# EAGLE design control board 1 (EAGLE 7.6.0)
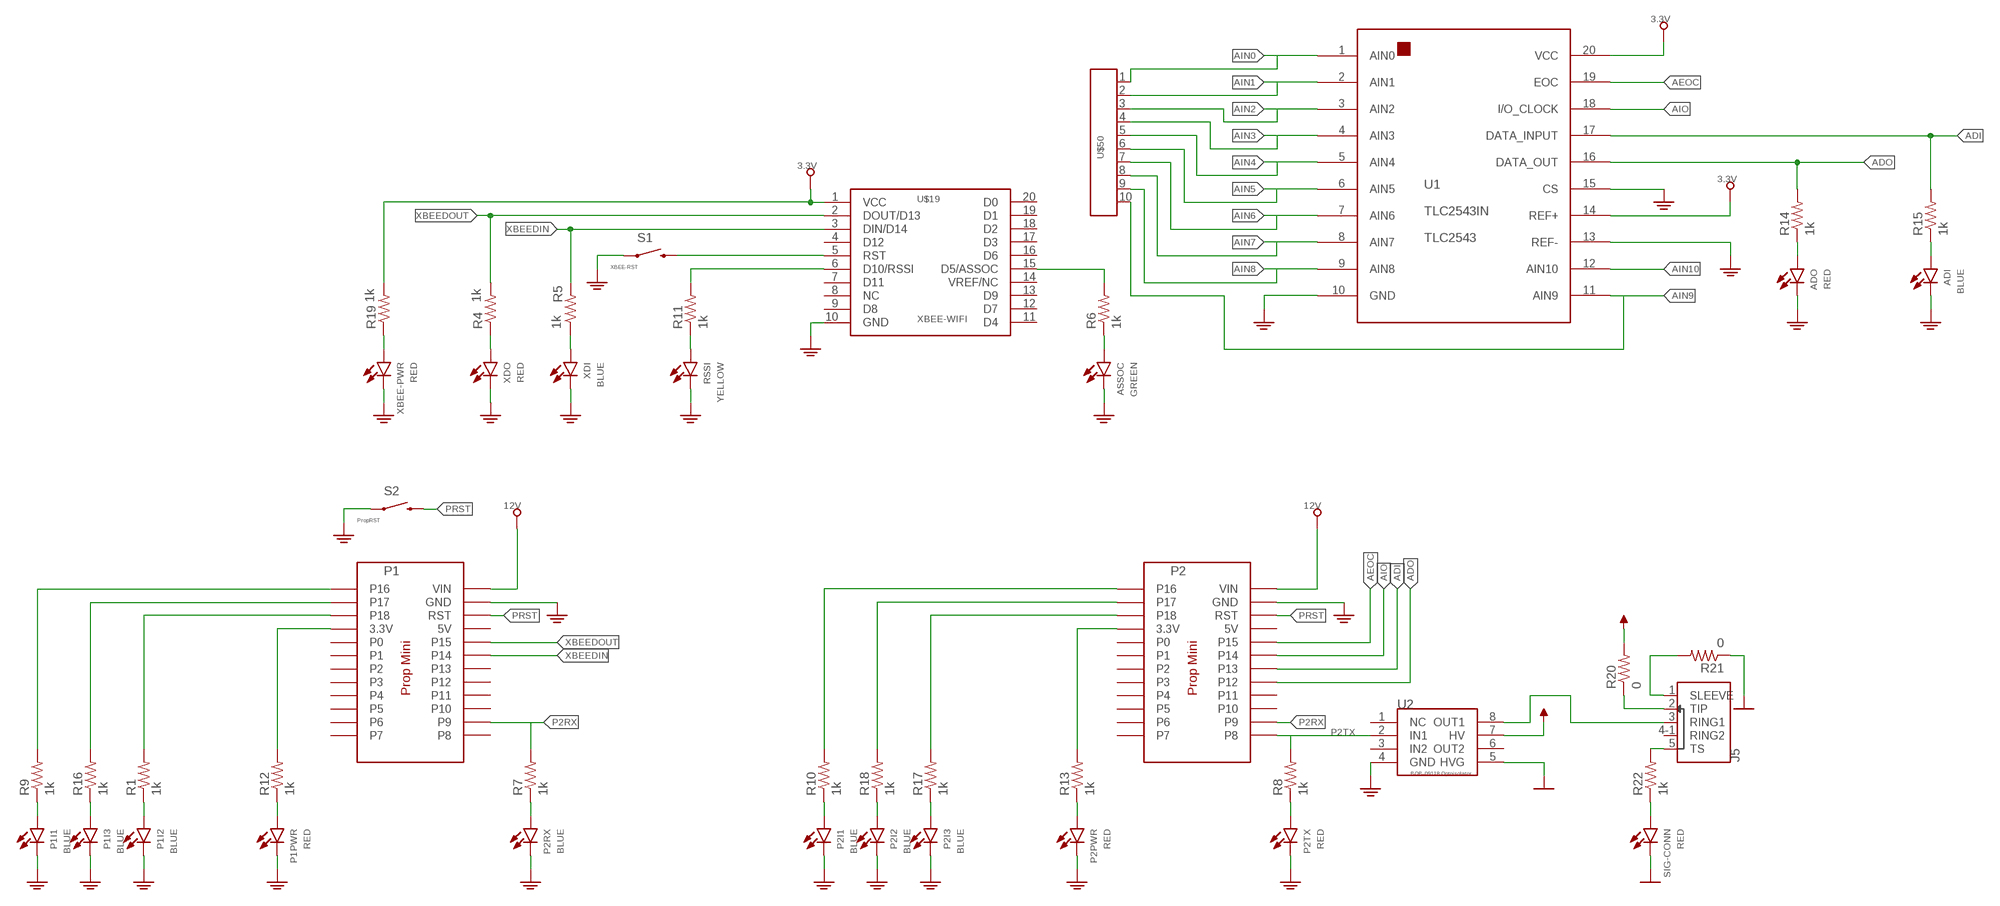
[diagram p0: schematic, sheet 1, part 1 of 2]
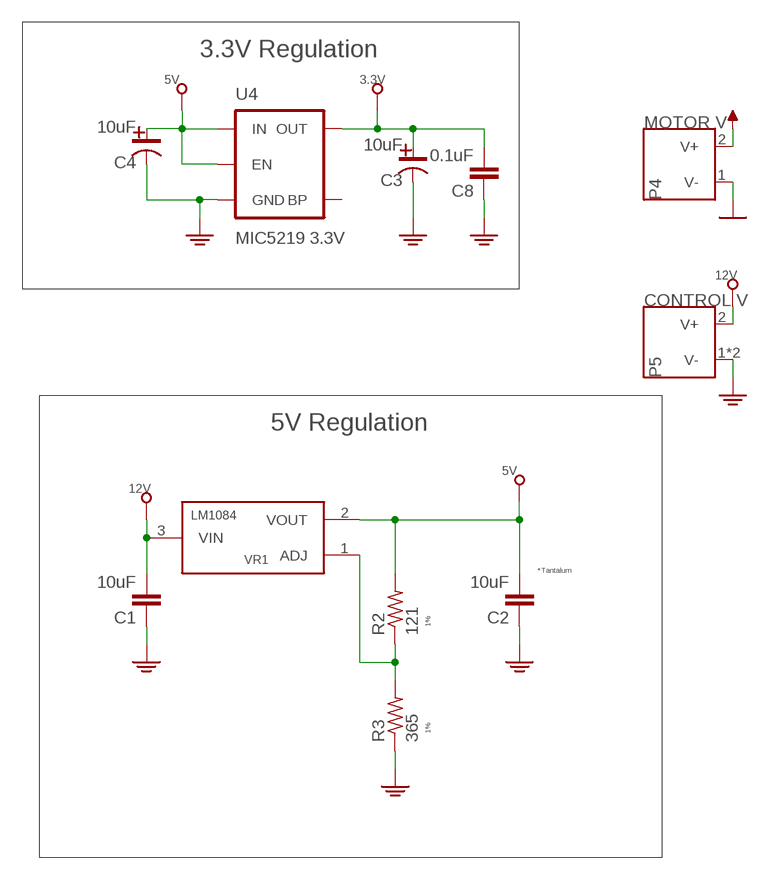
[diagram p1: schematic, sheet 1, part 2 of 2]

## Parts
ADI  BLUE  LED-STD  [0603]
ADO  RED  LED-STD  [0603]
ASSOC  GREEN  LED-STD  [0603]
C1  10uF  C0603  [0603]
C2  10uF  C0603  [0603]
C3  10uF  C-POL-T  [0603-POL]
C4  10uF  C-POL-T  [0603-POL]
C8  0.1uF  C0603  [0603]
J5  SJ1-42535TS  [SJ1-42534-SMT]
P1  PROP-MINI  [PROP-MINI]
P1I1  BLUE  LED-STD  [0603]
P1I2  BLUE  LED-STD  [0603]
P1I3  BLUE  LED-STD  [0603]
P1PWR  RED  LED-STD  [0603]
P2  PROP-MINI  [PROP-MINI]
P2I1  BLUE  LED-STD  [0603]
P2I2  BLUE  LED-STD  [0603]
P2I3  BLUE  LED-STD  [0603]
P2PWR  RED  LED-STD  [0603]
P2RX  BLUE  LED-STD  [0603]
P2TX  RED  LED-STD  [0603]
P4  MOTOR V  SINGLE-LINE"  [PJ-002BH-SMT-TR]
P5  CONTROL V  SINGLE-LINE'  [PJ-037A]
R1  1k  R0603  [0603]
R2  121  R0603  [0603]
R3  365  R0603  [0603]
R4  1k  R0603  [0603]
R5  1k  R0603  [0603]
R6  1k  R0603  [0603]
R7  1k  R0603  [0603]
R8  1k  R0603  [0603]
R9  1k  R0603  [0603]
R10  1k  R0603  [0603]
R11  1k  R0603  [0603]
R12  1k  R0603  [0603]
R13  1k  R0603  [0603]
R14  1k  R0603  [0603]
R15  1k  R0603  [0603]
R16  1k  R0603  [0603]
R17  1k  R0603  [0603]
R18  1k  R0603  [0603]
R19  1k  R0603  [0603]
R20  0  R0603  [0603]
R21  0  R0603  [0603]
R22  1k  R0603  [0603]
RSSI  YELLOW  LED-STD  [0603]
S1  XBEE-RST  SWITCH-MOMENTARY-2SMD-2  [TACTILE_SWITCH_SMD-2]
S2  PropRST  SWITCH-MOMENTARY-2SMD-2  [TACTILE_SWITCH_SMD-2]
SIG-CONN  RED  LED-STD  [0603]
U1  TLC2543IN  [DIL-20]
U2  BOB-09118  [DIL08-0.1P-6W]
U4  MIC5219 3.3V  V_REG_MIC52193.3V  [SOT23-5]
U$19  XBEE-WIFI  [XBEE-STD]
U$50  1X10  [DIP0.1-1X10]
VR1  LM1084  [TO-220]
XBEE-PWR  RED  LED-STD  [0603]
XDI  BLUE  LED-STD  [0603]
XDO  RED  LED-STD  [0603]

## Nets
3.3V: C3.2 C8.2 R19.2 U1.14(REF+) U1.20(VCC) U4.5(OUT) U$19.1(VCC)
5V: C2.2 C4.2 R2.2 U4.1(IN) U4.3(EN) VR1.2(VOUT)
12V: C1.2 P1.VIN P2.VIN P5.2(V+) VR1.3(VIN)
ADI: P2.P13 R15.2 U1.17(DATA_INPUT)
ADO: P2.P12 R14.2 U1.16(DATA_OUT)
AEOC: P2.P15 U1.19(EOC)
AIN0: U1.1(AIN0) U$50.1
AIN1: U1.2(AIN1) U$50.2
AIN2: U1.3(AIN2)
AIN3: U1.4(AIN3) U$50.4
AIN4: U1.5(AIN4) U$50.5
AIN5: U1.6(AIN5) U$50.6
AIN6: U1.7(AIN6) U$50.7
AIN7: U1.8(AIN7) U$50.8
AIN8: U1.9(AIN8) U$50.9
AIN9: U1.11(AIN9) U$50.10
AIN10: U1.12(AIN10)
AIO: P2.P14 U1.18(I/O_CLOCK)
GND: ADI.OUT ADO.OUT ASSOC.OUT C1.1 C2.1 C3.1 C4.1 C8.1 P1.GND P1I1.OUT P1I2.OUT P1I3.OUT P1PWR.OUT P2.GND P2I1.OUT P2I2.OUT P2I3.OUT P2PWR.OUT P2RX.OUT P2TX.OUT P5.1(V-) P5.1.(V-) R3.1 RSSI.OUT S1.2 S2.2 U1.10(GND) U1.13(REF-) U1.15(CS) U2.4(GND) U4.2(GND) U$19.10(GND) XBEE-PWR.OUT XDI.OUT XDO.OUT
GND2: P4.1(V-) R21.1 SIG-CONN.OUT U2.5(HVG)
N$1: R4.1 XDO.IN
N$2: P1I1.IN R9.1
N$3: P1.P18 R1.2
N$4: ADO.IN R14.1
N$5: R11.1 RSSI.IN
N$6: ADI.IN R15.1
N$7: R5.1 XDI.IN
N$8: J5.3(RING1) U2.8(OUT1)
N$9: R6.2 U$19.15(D5/ASSOC)
N$10: ASSOC.IN R6.1
N$11: P1.3.3V R12.2
N$12: P1I3.IN R16.1
N$13: P2.3.3V R13.2
N$14: P1I2.IN R1.1
N$15: P1PWR.IN R12.1
N$16: R19.1 XBEE-PWR.IN
N$17: J5.1(SLEEVE) R21.2
N$18: P2RX.IN R7.1
N$19: P2I1.IN R10.1
N$20: S1.1 U$19.5(RST)
N$21: R2.1 R3.2 VR1.1(ADJ)
N$22: R11.2 U$19.6(D10/RSSI)
N$23: P1.P16 R9.2
N$24: P2I2.IN R18.1
N$25: P2.P16 R10.2
N$26: P2I3.IN R17.1
N$27: P1.P17 R16.2
N$28: P2PWR.IN R13.1
N$29: P2.P18 R17.2
N$30: P2TX.IN R8.1
N$31: P2.P17 R18.2
N$32: J5.2(TIP) R20.1
N$33: R22.1 SIG-CONN.IN
N$34: J5.5(TS) R22.2
P2RX: P1.P9 P2.P9 R7.2
P2TX: P2.P8 R8.2 U2.2(IN1)
PRST: P1.RST P2.RST S2.1
VCC2: P4.2(V+) R20.2 U2.7(HV)
XBEEDIN: P1.P14 R5.2 U$19.3(DIN/D14)
XBEEDOUT: P1.P15 R4.2 U$19.2(DOUT/D13)
Unconnected: J5.4-1(RING2) P1.5V P1.P0 P1.P1 P1.P2 P1.P3 P1.P4 P1.P5 P1.P6 P1.P7 P1.P8 P1.P10 P1.P11 P1.P12 P1.P13 P2.5V P2.P0 P2.P1 P2.P2 P2.P3 P2.P4 P2.P5 P2.P6 P2.P7 P2.P10 P2.P11 U2.1(NC) U2.3(IN2) U2.6(OUT2) U4.4(BP) U$19.4(D12) U$19.7(D11) U$19.8(NC) U$19.9(D8) U$19.11(D4) U$19.12(D7) U$19.13(D9) U$19.14(VREF/NC) U$19.16(D6) U$19.17(D3) U$19.18(D2) U$19.19(D1) U$19.20(D0) U$50.3

## Notes on the sheet
- 3.3V Regulation
- 5V Regulation
- *Tantalum
- 1%
- 1%

## Library data of the parts
ADI ADO ASSOC P1I1-P1I3 P1PWR P2I1-P2I3 P2PWR P2RX P2TX RSSI SIG-CONN XBEE-PWR XDI XDO = led:LED-STD
C1 C2 C8 = RCL:C
C3 C4 = RCL:C-POL; CAP-TYPE: TANTALUM
J5 = audio-connectors:SJ1-42535; MNT: SMT
P1 P2 = Microcontrollers:PROP-MINI
P4 P5 = PWR-Connectors:SINGLE-LINE: 4UCON Part Num: 18742
R1-R22 = RCL:R
S1 S2 = SparkFun-Electromechanical:SWITCH-MOMENTARY-2: Various NO switches- pushbuttons, reed, etc; PROD_ID: SWCH-09213
U1 = ADC:TLC2543IN
U2 = Optoisolation:BOB-09118
U4 = SparkFun-PowerIC:V_REG_MIC5219: V_REG MIC5219 Standard 3.3V and 5V 500mA LDO voltage regulator in SOT-23 layout. Micrel part MIC5219. BP (by-pass) pin is used to lower output noise with 470pF cap, may be left open.; PROD_ID: VREG-09872
U$19 = RF:XBEE-WIFI
U$50 = headers:1X10; DIP: 0.1
VR1 = Voltage Regulators:LM1084

## Board
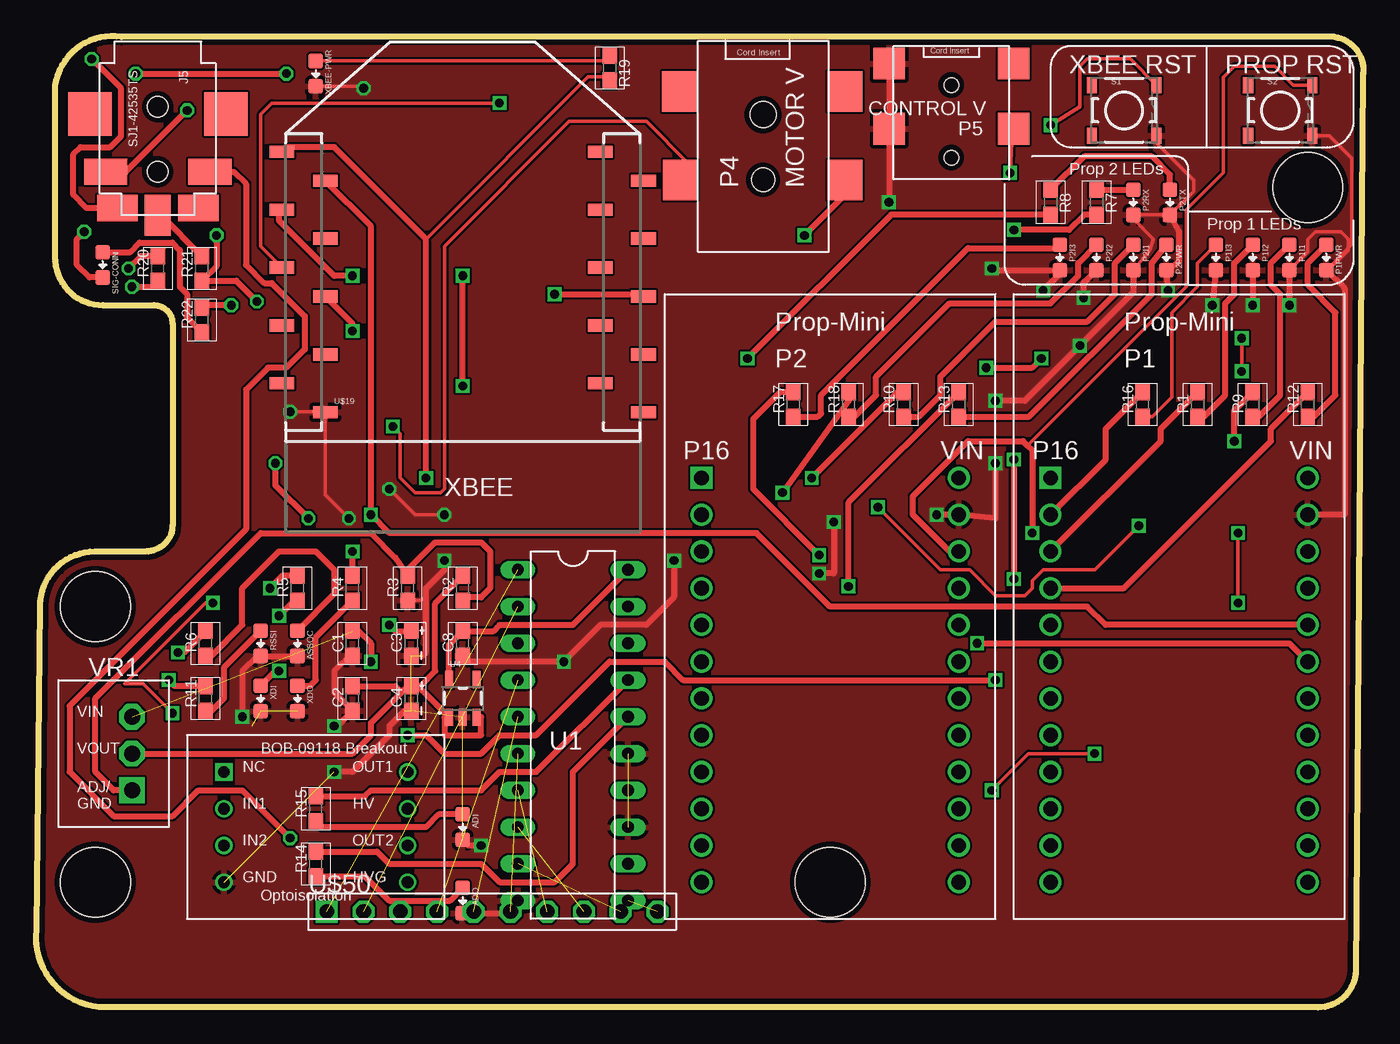
[diagram p2: board, top side]
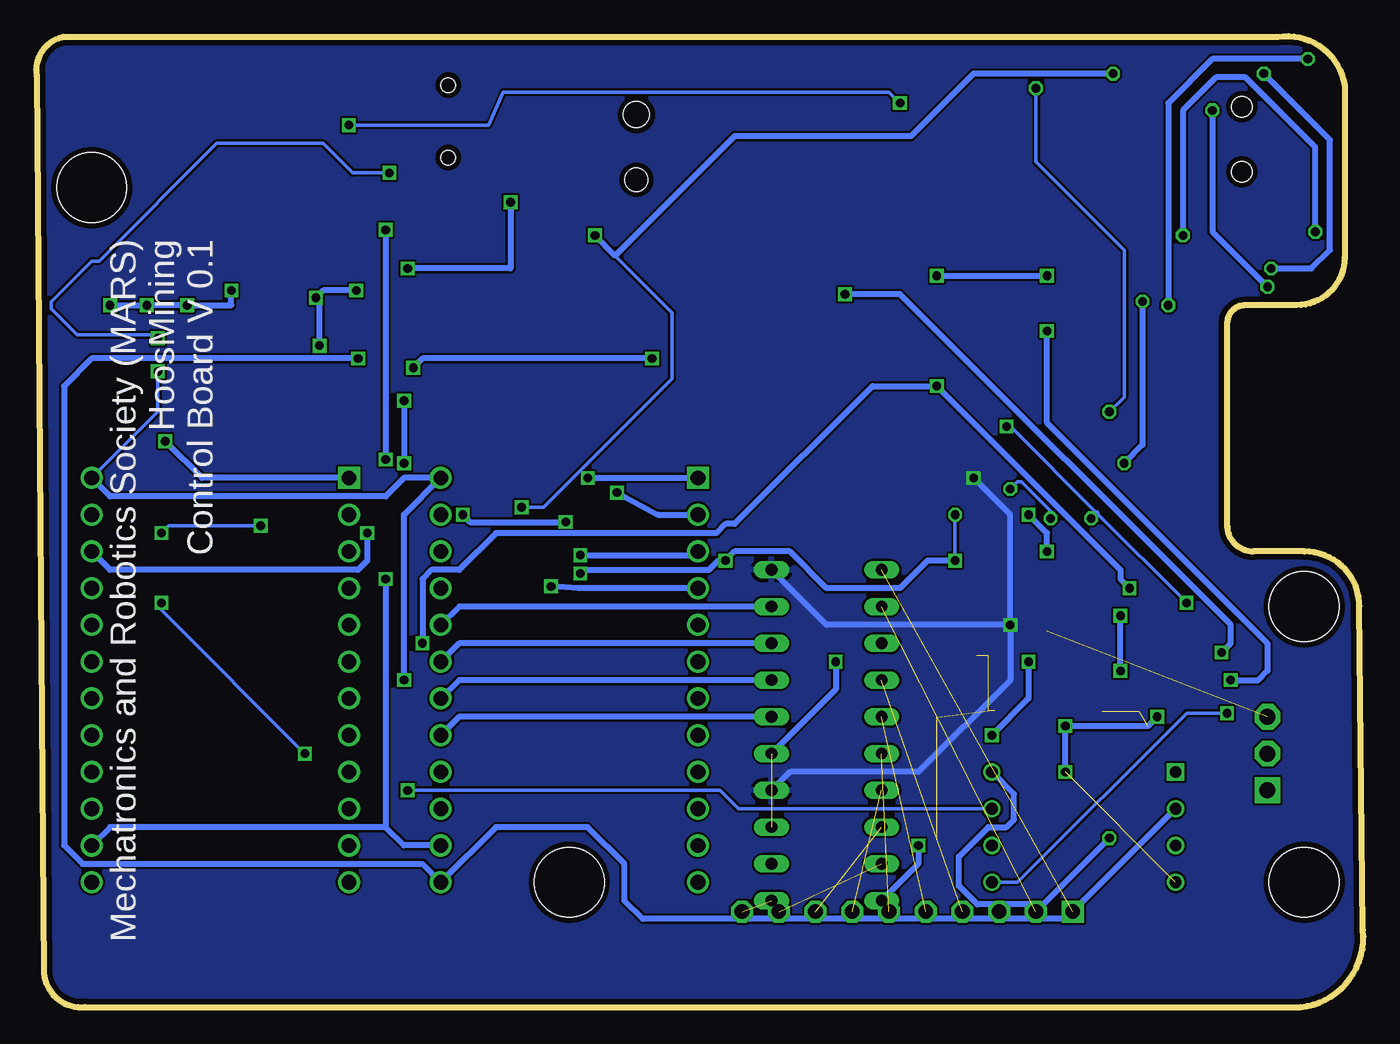
[diagram p3: board, bottom side, seen from below]

Size 91.75 x 67.12 mm. Coordinates in mm from the lower left corner, seen from the top.
Outline: 89.79,67.07 5.9,67.07 arc90 1.3,63.73 1.3,51.84 arc90 4.61,48.53 8.15,48.53 arc-90 9.42,47.26 9.42,33.34 arc-90 7.59,31.51 4.06,31.51 arc90 0.28,27.73 0.03,5.35 arc90 4.35,0.01 88.37,0.01 arc90 91.21,2.34 91.72,64.37 arc90 89.79,67.07
Copper layers (1*16): Top 0.0356mm / dielectric 1.5011mm / Bottom 0.0356mm
Design rules "LaenPCBOrder": minimum track width 6mil, minimum drill 13mil, track to track 6mil, track to pad 6mil, pad to pad 6mil, via to via 6mil, smd to smd 6mil, copper to edge 15mil, drill to drill 6mil, minimum pad ring 7mil, minimum via ring 7mil, stop-mask expansion 3mil, vias tented up to drill 0mil, thermal gap 10mil
Holes 4.83 mm at 4.09,8.65 4.09,27.7 87.91,56.65 54.89,8.65

### Footprints (pad centres in the part's own frame; a part is rotated, then mirrored left to right if it is on the bottom)
0603 = smd 1 x 1: IN 0,-0.877; OUT 0,0.877
0603' = smd 1.1 x 1: 1 -0.85,0; 2 0.85,0
0603-POL = smd 1.1 x 1: 1 -0.85,0; 2 0.85,0
SJ1-42534-SMT = smd 2.8 x 1.8: 1 7.5,0 | smd 1.8 x 3: 2 4.5,-3.6; 3 4.5,3.6 | smd 3 x 3: 4-1 0.5,4.7; 4-2 0.5,-4.7 | smd 1.8 x 2.8: 5 7,-2.8; 6 7,2.8 | hole 1.4: 0,0; 4.5,0
PROP-MINI = drill 1.016: 3.3V -8.89,6.35; 5V 8.89,6.35; GND 8.89,11.43; P0 -8.89,3.81; P1 -8.89,1.27; P2 -8.89,-1.27; P3 -8.89,-3.81; P4 -8.89,-6.35; P5 -8.89,-8.89; P6 -8.89,-11.43; P7 -8.89,-13.97; P8 8.89,-13.97; P9 8.89,-11.43; P10 8.89,-8.89; P11 8.89,-6.35; P12 8.89,-3.81; P13 8.89,-1.27; P14 8.89,1.27; P15 8.89,3.81; P17 -8.89,11.43; P18 -8.89,8.89; RST 8.89,8.89; VIN 8.89,13.97 | drill 1.016 square: P16 -8.89,13.97
PJ-002BH-SMT-TR = smd 2.8 x 2.4: 1 -2,5.035; 1. 4.1,5.08; 2 -2,-6.35; 3 4.1,-6.35 | hole 1.6: -2,-0.7 | hole 1.803: 2.5,-0.7
PJ-037A = smd 2.2 x 2.2: 1 4.3,0.5; 1. 4.3,-4; 2 -4.3,0.5; 3 -4.3,-4 | hole 1: 0,2.5; 0,-2.5
TACTILE_SWITCH_SMD-2 = smd 0.7 x 1.1: 1 2.225,1.75; 2 2.225,-1.75; 3 -2.225,-1.75; 4 -2.225,1.75
DIL-20 = drill 0.813 long: 1 -8.89,6.35; 2 -8.89,3.81; 3 -8.89,1.27; 4 -8.89,-1.27; 5 -8.89,-3.81; 6 -8.89,-6.35; 7 -8.89,-8.89; 8 -8.89,-11.43; 9 -8.89,-13.97; 10 -8.89,-16.51; 11 -1.27,-16.51; 12 -1.27,-13.97; 13 -1.27,-11.43; 14 -1.27,-8.89; 15 -1.27,-6.35; 16 -1.27,-3.81; 17 -1.27,-1.27; 18 -1.27,1.27; 19 -1.27,3.81; 20 -1.27,6.35
DIL08-0.1P-6W = drill 0.8 square: 1 -5.08,5.08 | drill 0.8: 2 -5.08,2.54; 3 -5.08,0; 4 -5.08,-2.54; 5 7.62,-2.54; 6 7.62,0; 7 7.62,2.54; 8 7.62,5.08
SOT23-5 = smd 0.55 x 1.2: 1 -0.95,-1.3; 2 0,-1.3; 3 0.95,-1.3; 4 0.95,1.3; 5 -0.95,1.3
XBEE-STD = smd 1.7 x 0.85: 1 -12.5,8.57; 2 -9.5,6.57; 3 -12.5,4.57; 4 -9.5,2.57; 5 -12.5,0.57; 6 -9.5,-1.43; 7 -12.5,-3.43; 8 -9.5,-5.43; 9 -12.5,-7.43; 10 -9.5,-9.43; 11 12.5,-9.43; 12 9.5,-7.43; 13 12.5,-5.43; 14 9.5,-3.43; 15 12.5,-1.43; 16 9.5,0.57; 17 12.5,2.57; 18 9.5,4.57; 19 12.5,6.57; 20 9.5,8.57
DIP0.1-1X10 = drill 1.016 square: 1 0,-11.43 | drill 1.016 octagon: 2 0,-8.89; 3 0,-6.35; 4 0,-3.81; 5 0,-1.27; 6 0,1.27; 7 0,3.81; 8 0,6.35; 9 0,8.89; 10 0,11.43
TO-220 = drill 1.1 pad 1.778 square: 1 0,-2.54 | drill 1.1 pad 1.778 octagon: 2 0,0; 3 0,2.54

### Placement (x,y rotation side)
ADI  29.49,12.46 180 top
ADO  29.49,7.38 180 top
ASSOC  18.06,25.16 180 top
C1  10uF  [0603']  21.87,25.16 90 top
C2  10uF  [0603']  21.87,21.35 90 top
C3  25.93,25.16 90 top
C4  25.93,21.35 90 top
C8  0.1uF  [0603']  29.49,25.16 90 top
J5  8.41,62.24 270 top
P1  79.02,22.62 0 top
P1I1  86.64,51.83 180 top
P1I2  84.1,51.83 180 top
P1I3  81.56,51.83 180 top
P1PWR  89.18,51.83 180 top
P2  54.89,22.62 0 top
P2I1  75.85,51.83 180 top
P2I2  73.31,51.83 180 top
P2I3  70.77,51.83 180 top
P2PWR  78.13,51.83 180 top
P2RX  75.85,55.64 180 top
P2TX  78.39,55.64 180 top
P4  49.56,59.19 90 top
P5  63.27,61.23 180 top
R1  1k  [0603']  80.29,41.67 90 top
R2  121  [0603']  29.49,28.97 90 top
R3  365  [0603']  25.68,28.97 90 top
R4  1k  [0603']  21.87,28.97 90 top
R5  1k  [0603']  18.06,28.97 90 top
R6  1k  [0603']  11.71,25.16 90 top
R7  1k  [0603']  73.31,55.64 270 top
R8  1k  [0603']  70.13,55.64 270 top
R9  1k  [0603']  84.1,41.67 90 top
R10  1k  [0603']  59.97,41.67 90 top
R11  1k  [0603']  11.71,21.35 90 top
R12  1k  [0603']  87.91,41.67 90 top
R13  1k  [0603']  63.78,41.67 90 top
R14  1k  [0603']  19.33,9.92 90 top
R15  1k  [0603']  19.33,13.73 90 top
R16  1k  [0603']  76.48,41.67 90 top
R17  1k  [0603']  52.35,41.67 90 top
R18  1k  [0603']  56.16,41.67 90 top
R19  1k  [0603']  39.65,64.91 270 top
R20  0  [0603']  8.41,51.07 90 top
R21  0  [0603']  11.46,51.07 90 top
R22  1k  [0603']  11.46,47.51 90 top
RSSI  15.52,25.16 180 top
S1  75.21,61.99 0 top
S2  86.01,61.99 0 top
SIG-CONN  4.6,51.32 180 top
U1  42.19,23.89 0 top
U2  18.06,11.19 0 top
U4  29.49,21.35 0 top
U$19  29.49,50.56 0 top
U$50  31.52,6.62 270 top
VR1  6.63,17.54 0 top
XBEE-PWR  19.33,64.53 180 top
XDI  15.52,21.35 180 top
XDO  18.06,21.35 180 top

### Tracks (layer width: path | path; a pad name or v marks a point on that pad's centre or on a via)
3.3V  (via drill 0.6)
  Top 0.254: R19.2 39.4,64.31 38.17,64.31 26.95,53.1
  Top 0.406: U4.5 28.54,25.06 C8.2 31.61,26.01 32.03,26.43 37.11,26.43 U1.20 | v24.41,26.43 24.83,26.01 C3.2 | v26.95,36.59 26.95,53.1 20.6,59.45 17.31,59.45 U$19.1
  Bottom 0.406: v24.41,26.43 37.11,26.43 U1.20 | v24.41,26.43 24.41,22.62 30.76,16.27 39.65,16.27 U1.14 | v24.41,26.43 24.41,34.05 v26.95,36.59
  pour Bottom: 0.28,70.88 0.28,-4.05 91.72,-4.05 91.72,70.88
5V
  Top 0.406: 26.39,22.2 U4.1 28.22,20.05 28.22,18.81 30.76,18.81 30.76,20.08 30.44,20.08 U4.3 | 26.39,22.2 26.53,22.2 27.59,23.25 27.59,27.91 R2.2 | VR1.2 21.87,17.54 23.14,18.81 23.14,19.66 25.26,21.77 | 26.39,22.2 C4.2 25.68,22.2 25.26,21.77 | C2.2 24.83,22.2 25.26,21.77
12V  (via drill 0.6)  (1 unrouted)
  Top 0.254: 67.45,59.81 v67.34,57.67 | v83.34,46.24 v83.34,43.95
  Top 0.406: C1.2 22.29,26.01 23.14,25.16 v23.14,23.89 | v25.68,18.81 26.95,18.81 28.22,17.54 30.76,17.54 32.03,18.81 34.57,18.81 39.65,23.89 43.46,23.89 44.73,22.62 v66.32,22.62 | P5.2 67.45,60.09 67.45,59.81
  Bottom 0.254: v67.34,57.67 69.88,57.67 71.91,59.7 79.27,59.7 87.4,51.57 87.91,51.57 90.7,48.78 90.7,48.27 88.93,46.49 83.59,46.49 v83.34,46.24 | v83.34,43.95 83.34,41.16 P1.VIN
  Bottom 0.406: v23.14,23.89 23.14,21.35 v25.68,18.81 | v66.32,22.62 66.32,34.05 P2.VIN 66.32,36.59 67.59,35.32 86.64,35.32 P1.VIN
ADI
  Top 0.406: R15.2 22.72,14.58 23.14,15 30.76,15 32.03,16.27 34.57,16.27 U1.17
  Bottom 0.406: U1.17 62.51,22.62 P2.P13
ADO
  Top 0.406: R14.2 23.56,10.77 24.41,9.92 30.76,9.92 32.03,8.65 35.84,8.65 37.11,9.92 37.11,16.27 U1.16
  Bottom 0.406: U1.16 62.51,20.08 P2.P12
AEOC
  Bottom 0.406: U1.19 62.51,27.7 P2.P15
AIN0  (1 unrouted)
AIN1  (1 unrouted)
AIN3  (1 unrouted)
AIN4  (1 unrouted)
AIN5  (1 unrouted)
AIN6  (1 unrouted)
AIN7  (1 unrouted)
AIN8  (1 unrouted)
AIN9  (1 unrouted)
AIO
  Bottom 0.406: U1.18 62.51,25.16 P2.P14
GND  (via drill 0.6)  (9 unrouted)
  Top 0.254: v21.62,33.79 19.99,35.42 U$19.10 19.96,41.16 v17.55,41.16 | v24.41,35.83 26.19,34.05 v28.22,34.05 | R3.1 26.61,28.12 26.95,28.46 | P2I1.OUT 76.99,52.32 77.24,53.1 75.85,54.5 P2RX.OUT P2TX.OUT 80.04,56.41 80.04,57.16 77.44,59.76 S1.2 | S2.2 89.41,60.24 90.96,58.69 90.96,52.73 P1PWR.OUT 89.32,50.95 90.7,52.34 90.7,53.1 90.2,53.61 88.42,53.61 87.91,53.1 87.91,52.22 P1I1.OUT | XBEE-PWR.OUT 22.49,63.65 v22.63,63.51
  Top 0.406: C1.1 21.66,24.31 20.6,23.25 20.6,21.77 C2.1 20.82,19.44 v20.6,19.44 | v14.25,20.08 14.25,23.25 15.28,24.28 RSSI.OUT ASSOC.OUT | 26.74,24.31 26.95,24.52 26.95,28.46 26.95,28.97 28.22,30.24 v28.22,30.87 | v44.1,30.87 44.1,28.33 42.19,26.43 39.02,26.43 v36.48,23.89 29.91,23.89 C8.1 | ADI.OUT 29.88,11.19 v30.76,11.19 | ADO.OUT 32.42,6.5 U1.10 | 25.47,20.5 24.41,19.44 24.41,18.81 21.87,16.27 v20.6,16.27 | P5.1. P5.1 58.97,55.66 v58.95,55.64 | v66.07,51.07 66.18,50.95 P2I3.OUT 70.77,50.69 v69.62,49.54 | P1PWR.OUT 90.45,49.68 90.45,34.05 P1.GND | P2I1.OUT 75.85,49.42 v72.16,45.73 68.35,41.92 v66.32,41.92 | v72.42,49.03 72.42,50.06 P2I2.OUT | P1I1.OUT v86.64,48.53 | P1I2.OUT v84.1,48.53 | P1I3.OUT v81.31,48.53 | v78.26,49.54 P2PWR.OUT 79.02,51.57 79.02,53.61 P2TX.OUT | v66.32,37.6 66.32,33.79 P2.GND v62.26,34.05 | v55.14,33.54 55.14,29.98 v54.13,29.98
  Bottom 0.254: v21.62,33.79 21.62,34.3 23.65,36.33 23.9,36.33 v24.41,35.83 | v28.22,34.05 v28.22,30.87 | v22.63,63.51 22.63,58.43 16.54,52.34 16.54,42.18 v17.55,41.16
  Bottom 0.406: v14.25,20.08 14.89,19.44 v20.6,19.44 v20.6,16.27 | v28.22,30.87 30.13,30.87 32.03,28.97 37.11,28.97 39.65,31.51 43.46,31.51 v44.1,30.87 44.6,30.87 45.24,30.24 53.87,30.24 v54.13,29.98 | v36.48,23.89 36.48,21.98 U1.15 | v30.76,11.19 30.76,9.92 U1.10 | v58.95,55.64 58.95,51.07 v66.07,51.07 | v72.16,45.73 72.16,48.78 v72.42,49.03 71.91,49.54 v69.62,49.54 | v86.64,48.53 v84.1,48.53 v81.31,48.53 78.26,48.53 v78.26,49.54 | v66.32,41.92 v66.32,37.6 | v62.26,34.05 61.75,33.54 v55.14,33.54
  pour Top: 0.28,31.51 0.28,-3.8 90.7,-4.05 91.72,70.88 0.53,70.88 0.53,31.51
GND2  (via drill 0.6)
  Top 0.254: 45.41,58.01 45.11,58.31 42.19,61.23 36.86,61.23 28.22,52.59 28.22,35.83 27.97,35.57 26.19,35.57 25.17,36.59 25.17,39.64 v24.66,40.14 | v12.22,27.95 11.71,27.95 6.12,22.36 7.39,22.36 v9.42,20.33
  Top 0.406: SIG-CONN.OUT 3.7,50.44 2.82,51.32 2.82,53.1 v3.33,53.61 | v12.47,53.35 12.47,51.23 R21.1 13.83,50.22 v15.27,48.78 | v16.54,37.6 16.54,36.08 v18.82,33.79 | P4.1 44.52,57.72 45.11,58.31
  Bottom 0.254: v24.66,40.14 24.41,40.14 18.44,34.18 v12.22,27.95 | v9.42,20.33 12.22,20.33 23.9,8.65 U2.5
  Bottom 0.406: v3.33,53.61 3.33,59.45 8.15,64.27 10.19,64.27 12.47,61.99 v12.47,53.35 | v15.27,48.78 15.27,38.87 v16.54,37.6 | v18.82,33.79 18.44,34.18
N$1
  Top 0.406: XDO.IN 18.94,22.23 19.33,22.62 19.33,25.58 R4.1
N$2
  Top 0.406: R9.1 84.52,40.82 86.01,42.3 86.01,49.29 85.37,49.92 85.37,51.44 P1I1.IN
N$3
  Top 0.406: P1.P18 77.75,39.13 77.75,39.98 R1.2
N$4
  Top 0.406: R14.1 22.72,9.07 24.41,7.38 28.61,7.38 ADO.IN
N$5
  Top 0.406: R11.1 12.13,20.5 12.98,21.35 12.98,23.5 RSSI.IN
N$6
  Top 0.406: ADI.IN 27.83,13.34 26.95,12.46 19.75,12.46 R15.1
N$7  (via drill 0.6)
  Top 0.406: XDI.IN 16.55,23.25 v16.79,23.25 | v16.79,27.06 17.85,28.12 R5.1
  Bottom 0.406: v16.79,23.25 v16.79,27.06
N$8  (via drill 0.6)
  Top 0.406: J5.3 13.67,57.74 14.5,56.91 14.5,51.32 15.77,50.05 16.28,50.05 18.57,47.76 18.57,45.48 17.3,44.21 16.03,44.21 14.5,42.68 14.5,33.03 2.31,20.84 2.31,16.27 5.36,13.22 9.42,13.22 11.2,15 14.25,15 v17.55,11.7
  Bottom 0.406: v17.55,11.7 22.12,7.12 26.7,7.12 27.97,8.39 27.97,10.43 25.93,12.46 24.66,12.46 24.16,12.97 24.16,14.74 U2.8
N$9  (via drill 0.6)
  Top 0.406: v35.84,49.29 41.83,49.29 U$19.15 | R6.2 10.23,24.52 v9.81,24.52
  Bottom 0.406: v35.84,49.29 32.03,49.29 9.17,26.43 9.17,25.16 v9.81,24.52
N$10
  Top 0.406: R6.1 12.13,24.31 14.25,26.43 14.25,28.97 16.79,31.51 19.33,31.51 20.6,30.24 20.6,28.58 ASSOC.IN
N$11
  Top 0.406: P1.3.3V 75.21,28.97 85.37,39.13 85.37,39.98 R12.2
N$12
  Top 0.254: P1I3.IN 80.29,51.44 80.29,49.8 78.51,48.02 78.51,42.18 77.15,40.82 R16.1
  Top 0.406: R16.1 76.9,40.82
N$13  (via drill 0.6)
  Top 0.406: v56.16,29.1 56.16,34.9 R13.2
  Bottom 0.406: P2.3.3V 54.26,28.97 v56.16,29.1
N$14
  Top 0.406: R1.1 80.71,40.82 82.2,42.3 82.2,48.65 82.83,49.29 82.83,51.44 P1I2.IN
N$15
  Top 0.406: R12.1 88.33,40.82 89.82,42.3 89.82,48.02 87.91,49.92 87.91,51.44 P1PWR.IN
N$16
  Top 0.254: XBEE-PWR.IN 39.3,65.41 R19.1
N$17
  Top 0.406: J5.1 8.63,54.74 R21.2
N$18
  Top 0.406: R7.1 75.82,56.49 P2RX.IN
N$19
  Top 0.406: R10.1 61.03,40.82 62.51,42.3 62.51,43.57 66.32,47.38 72.67,47.38 74.58,49.29 74.58,51.44 P2I1.IN
N$20  (via drill 0.6)
  Top 0.254: U$19.5 15.52,52.6 15.52,61.73 16.28,62.5 v32.03,62.5 | v70.13,60.97 72.16,62.24 72.16,65.04 72.67,65.54 75.63,65.54 S1.1
  Bottom 0.254: v32.03,62.5 32.79,63.26 59.46,63.26 60.48,60.97 v70.13,60.97
N$21
  Top 0.406: VR1.1 5.36,15 4.09,16.27 4.09,21.35 15.52,32.78 23.14,32.78 24.83,31.09 R3.2 25.68,30.24 27.59,32.14 30.76,32.14 31.4,31.51 31.4,28.97 30.76,28.33 29.71,28.33 R2.1
N$22  (via drill 0.6)
  Top 0.406: R11.2 9.59,22.2 v9.17,22.62 | v21.87,46.75 21.87,47.25 U$19.6
  Bottom 0.406: v9.17,22.62 7.27,22.62 6.63,23.25 6.63,25.16 21.87,40.4 v21.87,46.75
N$23  (via drill 0.6)
  Top 0.406: v82.83,39.13 82.83,41.25 R9.2
  Bottom 0.406: P1.P16 80.29,36.59 v82.83,39.13
N$24
  Top 0.406: R18.1 56.58,40.82 58.07,42.3 58.07,43.57 63.15,48.65 70.13,48.65 72.04,50.56 72.04,51.44 P2I2.IN
N$25  (via drill 0.6)
  Top 0.406: R10.2 59.55,42.52 v53.62,36.59
  Bottom 0.406: v53.62,36.59 P2.P16
N$26
  Top 0.406: R17.1 54.04,40.82 54.26,41.03 54.26,42.3 64.42,52.46 70.52,52.46 P2I3.IN
N$27
  Top 0.406: P1.P17 73.94,37.86 73.94,39.98 R16.2
N$28
  Top 0.406: R13.1 68.65,40.82 77.12,49.29 77.12,51.44 P2PWR.IN
N$29  (via drill 0.6)
  Top 0.406: R17.2 51.42,42.52 49.56,40.65 49.56,35.83 v54.13,31.25
  Bottom 0.406: v54.13,31.25 46.25,31.25 P2.P18
N$30
  Top 0.406: P2TX.IN 78.39,57.54 77.12,58.81 72.46,58.81 R8.1
N$31  (via drill 0.6)
  Top 0.406: R18.2 56.16,41.92 v51.59,35.57
  Bottom 0.406: v51.59,35.57 48.79,34.05 P2.P17
N$32  (via drill 0.6)
  Top 0.406: J5.2 6.19,57.74 v10.44,61.99 | v6.63,49.8 7.99,49.8 R20.1
  Bottom 0.406: v10.44,61.99 10.44,53.61 v6.63,49.8
N$33
  Top 0.406: SIG-CONN.IN 6.49,52.2 7.14,52.84 9.42,52.84 9.93,52.34 9.93,49.8 10.44,49.29 10.44,47.68 R22.1
N$34  (via drill 0.6)
  Top 0.406: J5.5 3.47,55.24 2.57,56.15 2.57,58.94 3.07,59.45 5.11,59.45 5.87,60.21 5.87,63.51 v3.84,65.54 | v13.49,48.53 11.62,48.53 R22.2
  Bottom 0.406: v3.84,65.54 10.44,65.54 13.49,62.5 v13.49,48.53
P2RX  (via drill 0.6)
  Top 0.406: R7.2 72.46,54.79 71.4,53.73 v67.59,53.73 | v67.59,37.86 v67.59,29.6
  Bottom 0.406: P2.P9 66.32,11.19 67.59,12.46 | 67.59,12.46 86.64,12.46 P1.P9 | v67.59,53.73 v67.59,37.86 | v67.59,29.6 67.59,12.46
P2TX  (via drill 0.6)
  Top 0.406: R8.2 59.12,54.79 v49.18,44.84 | v65.69,44.21 68.86,44.21 v69.5,44.84
  Bottom 0.406: U2.2 20.6,6.11 49.81,6.11 51.08,7.38 51.08,9.92 53.62,12.46 59.97,12.46 P2.P8 65.05,9.92 88.55,9.92 89.82,11.19 89.82,42.94 87.91,44.84 v69.5,44.84 | v49.18,44.84 65.05,44.84 v65.69,44.21
PRST  (via drill 0.6)
  Top 0.254: S2.1 86.92,63.74 85.62,65.04 82.83,65.04 82.07,64.27 82.07,57.67 79.53,55.13 79.53,49.8 68.54,38.81
  Top 0.406: P2.RST 63.15,31.51 60.61,34.05 60.61,35.32 64.42,39.13 68.23,39.13 68.54,38.81 68.86,38.49 v68.86,32.78
  Bottom 0.406: P1.RST 86.64,30.24 69.5,30.24 68.86,30.87 v68.86,32.78
VCC2  (via drill 0.6)
  Top 0.254: v66.07,15 68.61,17.54 v73.18,17.54 | v83.08,27.95 v83.08,32.78 | v76.23,33.29 73.18,30.24 69.62,30.24 68.86,29.48 68.86,28.97 68.35,28.46 66.32,28.46 64.54,30.24 62.51,30.24 v58.19,34.56
  Top 0.406: R20.2 7.23,51.92 v6.38,51.07 | v6.88,64.53 v17.3,64.53 | P4.2 55.91,56.15 v53.11,53.35
  Bottom 0.254: U2.7 43.21,13.73 44.48,15 v66.07,15 | v73.18,17.54 83.08,27.44 v83.08,27.95 | v83.08,32.78 82.58,33.29 v76.23,33.29 | v58.19,34.56 56.67,34.56 47.78,43.45 47.78,48.02 51.72,51.96
  Bottom 0.406: v6.38,51.07 3.58,51.07 2.31,52.34 2.31,59.96 v6.88,64.53 | v17.3,64.53 26.95,64.53 31.27,60.21 43.46,60.21 51.72,51.96 v53.11,53.35
XBEEDIN  (via drill 0.6)
  Top 0.406: v29.49,42.94 v29.49,50.56 | v21.87,50.56 20.6,50.56 16.79,54.37 16.79,54.93 U$19.3 | v65.05,25.16 86.64,25.16 P1.P14 | R5.2 17.01,29.82 v16.16,28.97
  Bottom 0.406: v29.49,50.56 v21.87,50.56 | v65.05,25.16 65.05,29.6 64.42,30.24 62.51,30.24 59.97,32.78 44.73,32.78 44.1,33.41 43.46,33.41 33.94,42.94 v29.49,42.94 16.79,30.24 16.79,29.6 v16.16,28.97
XBEEDOUT  (via drill 0.6)
  Top 0.406: R4.2 v21.87,31.51 | U$19.2 23.14,53.98 v23.14,34.05 24.41,32.78 49.81,32.78 54.89,27.7 72.67,27.7 73.94,26.43 P1.P15
  Bottom 0.406: v21.87,31.51 21.87,32.78 v23.14,34.05

### Text on the board
tPlace: XBEE RST | PROP RST | Prop 2 LEDs | Prop 1 LEDs | VR1
bPlace: Mechatronics and Robotics Society (MARS) / HoosMining / Control Board V 0.1